# EAGLE design esp32-esp32s3_adapter (EAGLE 9.6.2)
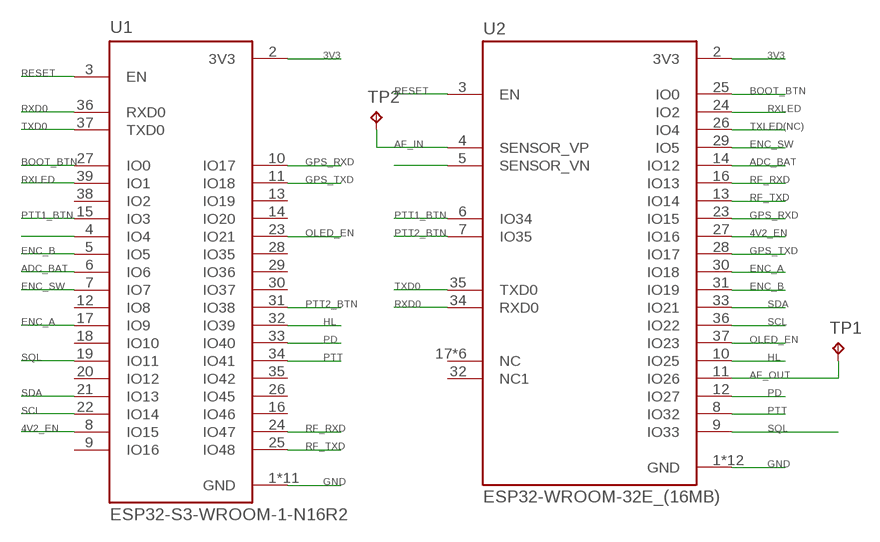
[diagram p0: schematic, sheet 1]

## Parts
TP1  TPB1,27  [B1,27]
TP2  TPB1,27  [B1,27]
U1  ESP32-S3-WROOM-1-N16R2  [XCVR_ESP32-S3-WROOM-1-N16R2]
U2  ESP32-WROOM-32E_(16MB)  [XCVR_ESP32-WROOM-32E_(16MB)]

## Nets
3V3: U1.2(3V3) U2.2(3V3)
4V2_EN: U1.8(IO15) U2.27(IO16)
ADC_BAT: U1.6(IO6) U2.14(IO12)
AF_IN: TP2.TP U2.4(SENSOR_VP)
AF_OUT: TP1.TP U2.11(IO26)
BOOT_BTN: U1.27(IO0) U2.25(IO0)
ENC_A: U1.17(IO9) U2.30(IO18)
ENC_B: U1.5(IO5) U2.31(IO19)
ENC_SW: U1.7(IO7) U2.29(IO5)
GND: U1.1(GND) U1.40(GND) U1.41_1(GND) U1.41_2(GND) U1.41_3(GND) U1.41_4(GND) U1.41_5(GND) U1.41_6(GND) U1.41_7(GND) U1.41_8(GND) U1.41_9(GND) U2.1(GND) U2.15(GND) U2.38(GND) U2.39_1(GND) U2.39_2(GND) U2.39_3(GND) U2.39_4(GND) U2.39_5(GND) U2.39_6(GND) U2.39_7(GND) U2.39_8(GND) U2.39_9(GND)
GPS_RXD: U1.10(IO17) U2.23(IO15)
GPS_TXD: U1.11(IO18) U2.28(IO17)
HL: U1.32(IO39) U2.10(IO25)
N$11: U1.4(IO4)
N$42: U2.5(SENSOR_VN)
OLED_EN: U1.23(IO21) U2.37(IO23)
PD: U1.33(IO40) U2.12(IO27)
PTT: U1.34(IO41) U2.8(IO32)
PTT1_BTN: U1.15(IO3) U2.6(IO34)
PTT2_BTN: U1.31(IO38) U2.7(IO35)
RESET: U1.3(EN) U2.3(EN)
RF_RXD: U1.24(IO47) U2.16(IO13)
RF_TXD: U1.25(IO48) U2.13(IO14)
RXD0: U1.36(RXD0) U2.34(RXD0)
RXLED: U1.39(IO1) U2.24(IO2)
SCL: U1.22(IO14) U2.36(IO22)
SDA: U1.21(IO13) U2.33(IO21)
SQL: U1.19(IO11) U2.9(IO33)
TXD0: U1.37(TXD0) U2.35(TXD0)
TXLED(NC): U2.26(IO4)
Unconnected: U1.9(IO16) U1.12(IO8) U1.13(IO19) U1.14(IO20) U1.16(IO46) U1.18(IO10) U1.20(IO12) U1.26(IO45) U1.28(IO35) U1.29(IO36) U1.30(IO37) U1.35(IO42) U1.38(IO2) U2.17(NC) U2.18(NC) U2.19(NC) U2.20(NC) U2.21(NC) U2.22(NC) U2.32(NC1)

## Library data of the parts
TP1 TP2 = testpad:TP: Test pad
U1 = ESP32-S3-WROOM-1-N16R2:ESP32-S3-WROOM-1-N16R2: Check availability <https://pricing.snapeda.com/parts/ESP32-S3-WROOM-1-N16R2/Espressif%20Systems/view-part?ref=eda>; AVAILABILITY: In Stock; DESCRIPTION: Bluetooth, WiFi 802.11b/g/n, Bluetooth v5.0 Transceiver Module 2.4GHz PCB Trace Surface Mount; MF: Espressif Systems; MP: ESP32-S3-WROOM-1-N16R2; PACKAGE: None; PRICE: None; PURCHASE-URL: https://pricing.snapeda.com/search?q=ESP32-S3-WROOM-1-N16R2&ref=eda
U2 = ESP32-WROOM-32E__16MB_:ESP32-WROOM-32E_(16MB): Check availability <https://pricing.snapeda.com/parts/ESP32-WROOM-32E%20%2816MB%29/Espressif%20Systems/view-part?ref=eda>; AVAILABILITY: Not in stock; DESCRIPTION: Bluetooth, WiFi 802.11b/g/n, Bluetooth v4.2 +EDR, Class 1, 2 and 3 Transceiver Module 2.4GHz ~ 2.5GHz Integrated, Trace Surface Mount; MF: Espressif Systems; MP: ESP32-WROOM-32E (16MB); PACKAGE: SMD-44 Espressif Systems; PRICE: None

## Board
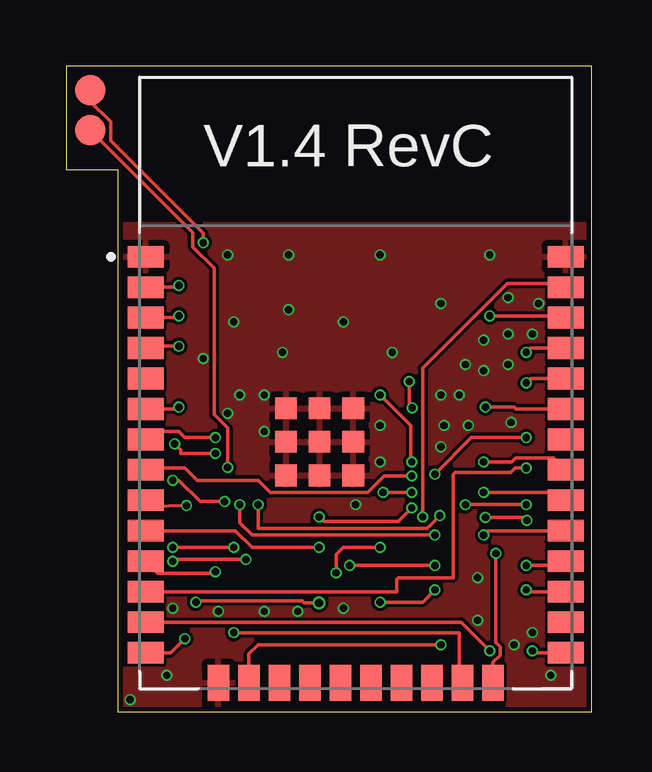
[diagram p1: board, top side]
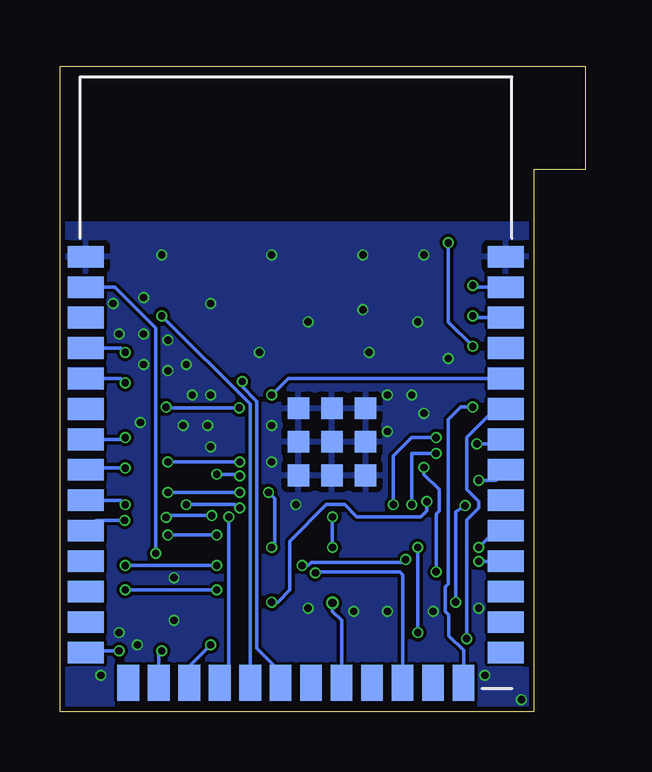
[diagram p2: board, bottom side, seen from below]

Size 21.9 x 26.91 mm. Coordinates in mm from the lower left corner, seen from the top.
Outline: 2.16,0 21.9,0 21.9,26.91 0,26.91 0,22.61 2.16,22.61 2.16,0
Copper layers (1*16): Top 0.035559375mm / dielectric 1.6mm / Bottom 0.035559375mm
Design rules "jlcpcb-2layers *": minimum track width 5mil, minimum drill 12mil, track to track 5mil, track to pad 5mil, pad to pad 5mil, via to via 5mil, smd to smd 5mil, copper to edge 8mil, drill to drill 6mil, minimum pad ring 5mil, minimum via ring 3mil, stop-mask expansion 2.5mil, vias tented up to drill 15mil, thermal gap 10mil

### Footprints (pad centres in the part's own frame; a part is rotated, then mirrored left to right if it is on the bottom)
B1,27 = smd 1.27 x 1.27: TP 0,0
XCVR_ESP32-S3-WROOM-1-N16R2 = smd 1.5 x 0.9 bottom: 1 -8.75,5.26; 2 -8.75,3.99; 3 -8.75,2.72; 4 -8.75,1.45; 5 -8.75,0.18; 6 -8.75,-1.09; 7 -8.75,-2.36; 8 -8.75,-3.63; 9 -8.75,-4.9; 10 -8.75,-6.17; 11 -8.75,-7.44; 12 -8.75,-8.71; 13 -8.75,-9.98; 14 -8.75,-11.25; 27 8.75,-11.25; 28 8.75,-9.98; 29 8.75,-8.71; 30 8.75,-7.44; 31 8.75,-6.17; 32 8.75,-4.9; 33 8.75,-3.63; 34 8.75,-2.36; 35 8.75,-1.09; 36 8.75,0.18; 37 8.75,1.45; 38 8.75,2.72; 39 8.75,3.99; 40 8.75,5.26 | smd 0.9 x 1.5 bottom: 15 -6.985,-12.5; 16 -5.715,-12.5; 17 -4.445,-12.5; 18 -3.175,-12.5; 19 -1.905,-12.5; 20 -0.635,-12.5; 21 0.635,-12.5; 22 1.905,-12.5; 23 3.175,-12.5; 24 4.445,-12.5; 25 5.715,-12.5; 26 6.985,-12.5 | smd 0.9 x 0.9 bottom: 41_1 -1.5,-2.46; 41_2 -2.9,-2.46; 41_3 -0.1,-2.46; 41_4 -2.9,-3.86; 41_5 -1.5,-3.86; 41_6 -0.1,-3.86; 41_7 -2.9,-1.06; 41_8 -1.5,-1.06; 41_9 -0.1,-1.06
XCVR_ESP32-WROOM-32E_(16MB) = smd 1.5 x 0.9: 1 -8.75,5.26; 2 -8.75,3.99; 3 -8.75,2.72; 4 -8.75,1.45; 5 -8.75,0.18; 6 -8.75,-1.09; 7 -8.75,-2.36; 8 -8.75,-3.63; 9 -8.75,-4.9; 10 -8.75,-6.17; 11 -8.75,-7.44; 12 -8.75,-8.71; 13 -8.75,-9.98; 14 -8.75,-11.25; 25 8.75,-11.25; 26 8.75,-9.98; 27 8.75,-8.71; 28 8.75,-7.44; 29 8.75,-6.17; 30 8.75,-4.9; 31 8.75,-3.63; 32 8.75,-2.36; 33 8.75,-1.09; 34 8.75,0.18; 35 8.75,1.45; 36 8.75,2.72; 37 8.75,3.99; 38 8.75,5.26 | smd 0.9 x 1.5: 15 -5.715,-12.5; 16 -4.445,-12.5; 17 -3.175,-12.5; 18 -1.905,-12.5; 19 -0.635,-12.5; 20 0.635,-12.5; 21 1.905,-12.5; 22 3.175,-12.5; 23 4.445,-12.5; 24 5.715,-12.5 | smd 0.9 x 0.9: 39_1 -2.9,-1.06; 39_2 -1.5,-1.06; 39_3 -0.1,-1.06; 39_4 -2.9,-2.46; 39_5 -1.5,-2.46; 39_6 -0.1,-2.46; 39_7 -2.9,-3.86; 39_8 -1.5,-3.86; 39_9 -0.1,-3.86

### Placement (x,y rotation side)
TP1  1.02,24.26 0 top
TP2  1.02,25.91 0 top
U1  12.06,13.72 0 top
U2  12.06,13.72 0 top

### Tracks (layer width: path | path; a pad name or v marks a point on that pad's centre or on a via)
3V3  (via drill 0.3)
  Top 0.152: v4.7,17.78 4.62,17.71 U2.2
  Bottom 0.152: U2.2 4.62,17.71 v4.7,17.78
4V2_EN  (via drill 0.3)
  Top 0.152: U2.27 19.25,5.01 v19.18,5.08 | v15.37,5.08 14.86,4.57 v13.08,4.57 | v6.6,8.76 5.59,8.76 4.7,9.65 v4.44,9.65
  Bottom 0.152: v19.18,5.08 v15.37,5.08 | v4.44,9.65 3.75,9.65 U1.8 | v13.08,4.57 12.83,4.57 12.32,5.08 12.32,7.11 10.79,8.64 10.03,8.64 9.53,8.13 6.86,8.13 6.6,8.38 v6.6,8.76
ADC_BAT  (via drill 0.3)
  Top 0.152: U2.14 4.37,2.47 v4.95,3.05
  Bottom 0.152: v4.95,3.05 4.95,8 4.44,8.51 4.44,8.76 4.95,9.27 4.95,11.43 3.76,12.63 U1.6
AF_IN  (via drill 0.3)
  Top 0.152: U2.4 3.24,15.24 v4.7,15.24 | TP2.TP 1.02,25.44 1.85,24.6 1.85,23.81 5.71,19.95 v5.71,19.56
  Bottom 0.152: v5.71,19.56 5.71,16.26 v4.7,15.24
AF_OUT  (via drill 0.3)
  Top 0.152: v6.73,10.19 6.73,11.84 6.17,12.39 6.17,18.49 5.28,19.38 5.28,19.99 TP1.TP | U2.11 3.82,5.77 6.15,5.77 v6.22,5.84
  Bottom 0.152: v6.73,10.19 6.73,9.91 6.1,9.27 6.1,8.38 6.22,8.26 v6.22,5.84
BOOT_BTN  (via drill 0.3)
  Top 0.152: U2.25 19.43,2.47 v19.43,2.54
  Bottom 0.152: v19.43,2.54 20.82,2.54 U2.25
ENC_A  (via drill 0.3)
  Top 0.152: v13.21,9.14 v14.4,9.14 | v17.4,9.14 20.49,9.14 U2.30 | v13.08,6.86 11.56,6.86 11.25,6.55 v11.25,5.79
  Bottom 0.152: v13.08,6.86 12.95,6.98 12.95,8.89 v13.21,9.14 | v14.4,9.14 v17.4,9.14 | U1.17 7.62,5.72 7.75,5.84 11.2,5.84 11.2,5.79 v11.25,5.79
ENC_B  (via drill 0.3)
  Top 0.152: v13.08,13.21 14.35,11.94 14.35,10.41 v14.4,10.41 | v17.4,10.41 18.57,10.41 18.74,10.59 20.31,10.59 U2.31
  Bottom 0.152: U1.5 12.39,13.9 v13.08,13.21 | v14.4,10.41 v17.4,10.41
ENC_SW  (via drill 0.3)
  Top 0.152: U2.29 17.58,7.55 v17.4,7.37 | v15.37,7.37 7.75,7.37 7.24,7.87 v7.24,8.64 | v4.52,11.18 4.77,10.92 4.79,10.77 v6.22,10.77
  Bottom 0.152: v17.4,7.37 v15.37,7.37 | v4.52,11.18 3.5,11.18 U1.7 | v7.24,8.64 7.24,10.77 v6.22,10.77
GND  (via drill 0.3)
  other vias: 2.67,0.51 4.19,1.52 8.25,4.19 9.65,4.19 11.56,4.32 17.15,3.81 18.67,2.79 19.43,3.3 20.19,1.52 17.15,5.59 19.43,15.75 18.42,14.48 18.42,15.75 7.24,13.21 6.73,12.45 8.25,11.68 8.25,13.21 13.08,10.41 6.73,19.05 13.08,19.05 17.65,19.05 9.27,19.05 6.98,16.26 11.56,16.26 15.62,17.02 9.27,16.76 5.71,14.73 9.02,14.99 13.59,14.99 18.42,17.27 17.4,15.49 17.4,14.22 15.62,13.21 16.64,14.48 16.38,13.21 19.69,17.02 6.35,4.19 4.44,4.32 12.06,8.64 13.08,11.94 15.75,11.94 15.62,11.05 16.76,11.94 18.54,12.06
  pour Top: 2.16,20.32 21.97,20.32 21.97,0 2.16,0
  pour Bottom: 2.16,20.32 21.97,20.32 21.97,0 2.16,0
GPS_RXD  (via drill 0.3)
  Top 0.152: U2.23 16.38,1.34 16.38,3.3 v6.98,3.3 | v6.98,6.86 v4.44,6.86
  Bottom 0.152: v6.98,6.86 v6.98,3.3 | v4.44,6.86 3.76,7.55 U1.10
GPS_TXD  (via drill 0.3)
  Top 0.152: U2.28 20.64,6.1 v19.18,6.1 | v7.49,6.35 4.44,6.35 v4.44,6.27 | v15.37,6.1 v11.81,6.1
  Bottom 0.152: v19.18,6.1 v15.37,6.1 | v11.81,6.1 11.56,6.1 11.43,6.22 7.62,6.22 v7.49,6.35 | v4.44,6.27 v4.44,6.28 U1.11
HL  (via drill 0.3)
  Top 0.152: U2.10 7.06,7.55 7.75,6.86 v10.54,6.86 | v19.18,8.64 v16.64,8.64 | v14.4,8.5 13.84,7.94 10.73,7.94 v10.54,8.13
  Bottom 0.152: U1.32 19.36,8.82 v19.18,8.64 | v10.54,6.86 v10.54,8.13 | v16.64,8.64 14.6,8.64 14.35,8.38 14.35,8.45 v14.4,8.5
OLED_EN  (via drill 0.3)
  Top 0.152: U2.37 20.67,17.85 18.38,17.85 14.86,14.33 v14.86,8.13
  Bottom 0.152: v14.86,8.13 14.86,1.6 U1.23
PD  (via drill 0.3)
  Top 0.152: U2.12 13.77,5.01 13.77,5.51 13.84,5.59 16.13,5.59 16.13,9.91 16.21,9.98 18.53,9.98 18.71,10.16 v19.18,10.16
  Bottom 0.152: v19.18,10.16 20.74,10.16 U1.33
PTT  (via drill 0.3)
  Top 0.152: v19.18,11.43 16.89,11.43 v15.37,9.91 | v14.4,9.83 13.26,9.83 12.57,9.14 8.51,9.14 8,9.65 5.46,9.65 4.95,10.16 3.39,10.16 U2.8
  Bottom 0.152: U1.34 19.25,11.36 v19.18,11.43 | v15.37,9.91 14.35,9.91 14.35,9.88 v14.4,9.83
PTT1_BTN  (via drill 0.3)
  Top 0.152: v4.7,12.7 4.62,12.63 U2.6
  Bottom 0.152: U1.15 5.08,2.56 5.69,3.17 5.69,4.04 5.84,4.19 5.84,5.21 5.71,5.33 5.71,12.19 5.21,12.7 v4.7,12.7
PTT2_BTN  (via drill 0.3)
  Top 0.152: v15.57,8.18 15.19,7.8 15.04,7.65 8,7.65 v8,8.64 | v17.48,8.1 19.08,8.1 v19.2,7.98 | v6.22,11.43 4.95,11.43 4.7,11.68 3.64,11.68 U2.7
  Bottom 0.152: v15.57,8.18 17.58,8.18 17.63,8.13 17.6,8.1 v17.48,8.1 | v19.2,7.98 20.38,7.98 U1.31 | v8,8.64 8,10.67 7.24,11.43 v6.22,11.43
RESET  (via drill 0.3)
  Top 0.152: U1.3 4.62,16.44 v4.7,16.51
  Bottom 0.152: v4.7,16.51 4.62,16.44 U1.3
RF_RXD  (via drill 0.3)
  Top 0.152: U2.16 7.62,2.41 8,2.79 v15.62,2.79
  Bottom 0.152: v15.62,2.79 16.51,1.91 U1.24
RF_TXD  (via drill 0.3)
  Top 0.152: U2.13 16.46,3.74 v17.65,2.54
  Bottom 0.152: v17.65,2.54 17.78,2.41 U1.25
RXD0  (via drill 0.3)
  Top 0.152: U1.36 19.36,13.9 v19.18,13.72
  Bottom 0.152: v19.18,13.72 19.36,13.9 U1.36
RXLED  (via drill 0.3)
  Top 0.152: U2.24 17.78,2.06 18.09,2.36 18.09,2.72 17.91,2.9 v17.91,6.6
  Bottom 0.152: v17.91,6.6 17.91,16 19.61,17.71 U1.39
SCL  (via drill 0.3)
  Top 0.152: v17.65,16.51 20.74,16.51 U2.36
  Bottom 0.152: U1.22 13.97,12.83 v17.65,16.51
SDA  (via drill 0.3)
  Top 0.152: v17.48,12.7 18.67,12.7 18.74,12.63 U2.33 | v14.3,13.77 14.3,12.75 14.38,12.67 v14.43,12.67
  Bottom 0.152: U1.21 12.7,1.65 13.69,2.64 13.69,12.94 14.35,13.6 14.35,13.72 v14.3,13.77 | v14.43,12.67 17.5,12.67 17.53,12.7 v17.48,12.7
SQL  (via drill 0.3, 0.35)
  Top 0.152: U2.9 3.56,8.57 v5.02,8.6 | v10.54,4.54 9.91,4.54 9.83,4.62 5.46,4.62 v5.41,4.57
  Bottom 0.152: v5.41,4.57 5.41,8.33 v5.02,8.6 | U1.19 10.16,3.81 10.54,4.19 v10.54,4.54
TXD0  (via drill 0.3)
  Top 0.152: v19.18,14.99 19.36,15.17 U1.37
  Bottom 0.152: U1.37 19.36,15.17 v19.18,14.99

### Text on the board
tNames: V1.4 RevC